# EAGLE design TeknoAmiga (EAGLE 6.4)
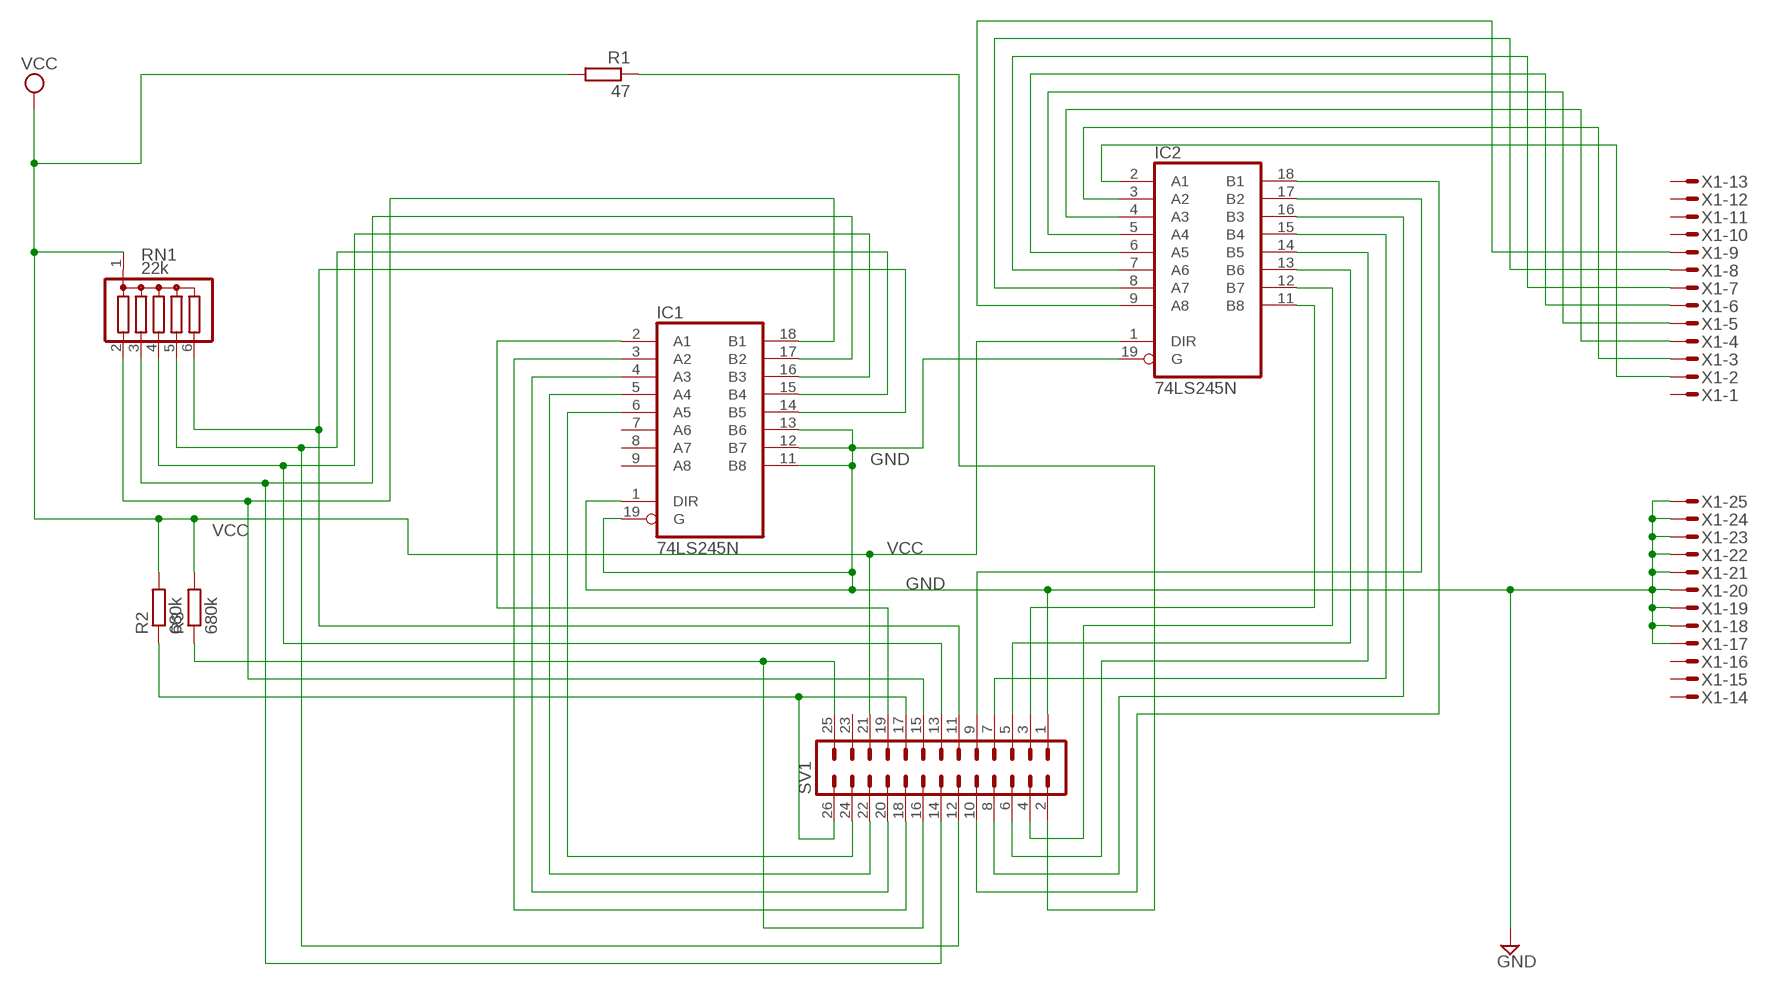
[diagram p0: schematic, sheet 1]

## Parts
IC1  74LS245N  [DIL20]
IC2  74LS245N  [DIL20]
R1  47  R-EU_0207/12  [0207/12]
R2  680k  R-EU_0207/12  [0207/12]
R3  680k  R-EU_0207/12  [0207/12]
RN1  22k  G05R  [SIL6]
SV1  MA13-2  [MA13-2]
X1  M25HPS  [M25HP]

## Nets
GND: IC1.1(DIR) IC1.11(B8) IC1.12(B7) IC1.13(B6) IC1.19(G) IC2.19(G) SV1.1 X1.17 X1.18 X1.19 X1.20 X1.21 X1.22 X1.23 X1.24 X1.25
N$1: IC2.2(A1) X1.2
N$2: IC2.3(A2) X1.3
N$3: IC2.4(A3) X1.4
N$4: IC2.5(A4) X1.5
N$5: IC2.6(A5) X1.6
N$6: IC2.7(A6) X1.7
N$7: IC2.8(A7) X1.8
N$8: IC2.9(A8) X1.9
N$9: IC1.14(B5) RN1.6 SV1.11
N$10: IC1.15(B4) RN1.5 SV1.12
N$11: IC1.16(B3) RN1.4 SV1.13
N$12: IC1.17(B2) RN1.3 SV1.14
N$13: IC1.18(B1) RN1.2 SV1.15
N$14: R2.1 SV1.17 SV1.26
N$15: R3.1 SV1.16 SV1.25
N$16: IC1.6(A5) SV1.24
N$17: IC1.5(A4) SV1.22
N$18: IC1.4(A3) SV1.20
N$19: IC1.3(A2) SV1.18
N$20: IC1.2(A1) SV1.19
N$21: R1.1 SV1.2
N$22: IC2.11(B8) SV1.3
N$23: IC2.12(B7) SV1.4
N$24: IC2.13(B6) SV1.5
N$25: IC2.14(B5) SV1.6
N$26: IC2.15(B4) SV1.7
N$27: IC2.16(B3) SV1.8
N$28: IC2.17(B2) SV1.9
N$29: IC2.18(B1) SV1.10
VCC: IC2.1(DIR) R1.2 R2.2 R3.2 RN1.1 SV1.21
Unconnected: IC1.7(A6) IC1.8(A7) IC1.9(A8) SV1.23 X1.1 X1.10 X1.11 X1.12 X1.13 X1.14 X1.15 X1.16

## Power pins joined to a net without a drawn wire
GND: IC1.10(GND) IC2.10(GND)
VCC: IC1.20(VCC) IC2.20(VCC)

## Library data of the parts
IC1 IC2 = 74xx-eu:74*245: Octal BUS TRANSCEIVER, 3-state
R1-R3 = resistor:R-EU_: RESISTOR, European symbol
RN1 = resistor-sil:G05R: SIL RESISTOR; OC_FARNELL: unknown; OC_NEWARK: unknown
SV1 = con-lstb:MA13-2: PIN HEADER; OC_FARNELL: unknown; OC_NEWARK: unknown
X1 = con-subd:M25?S: SUB-D; OC_FARNELL: unknown; OC_NEWARK: unknown

## Board
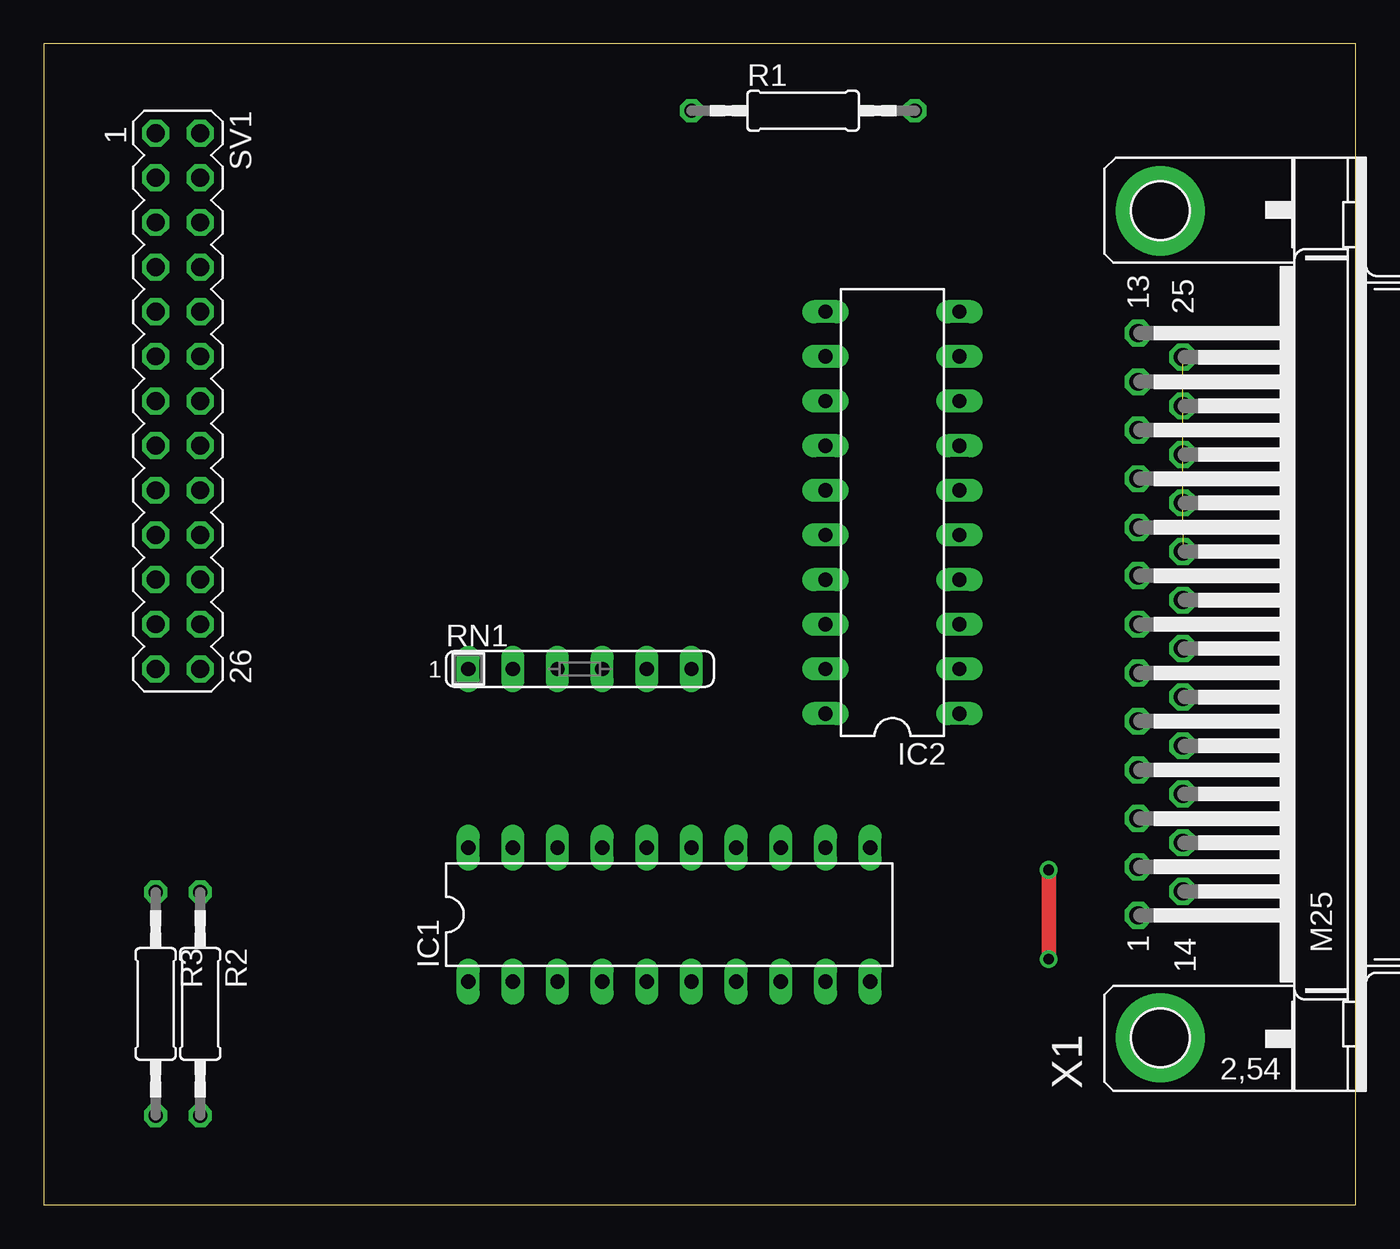
[diagram p1: board, top side]
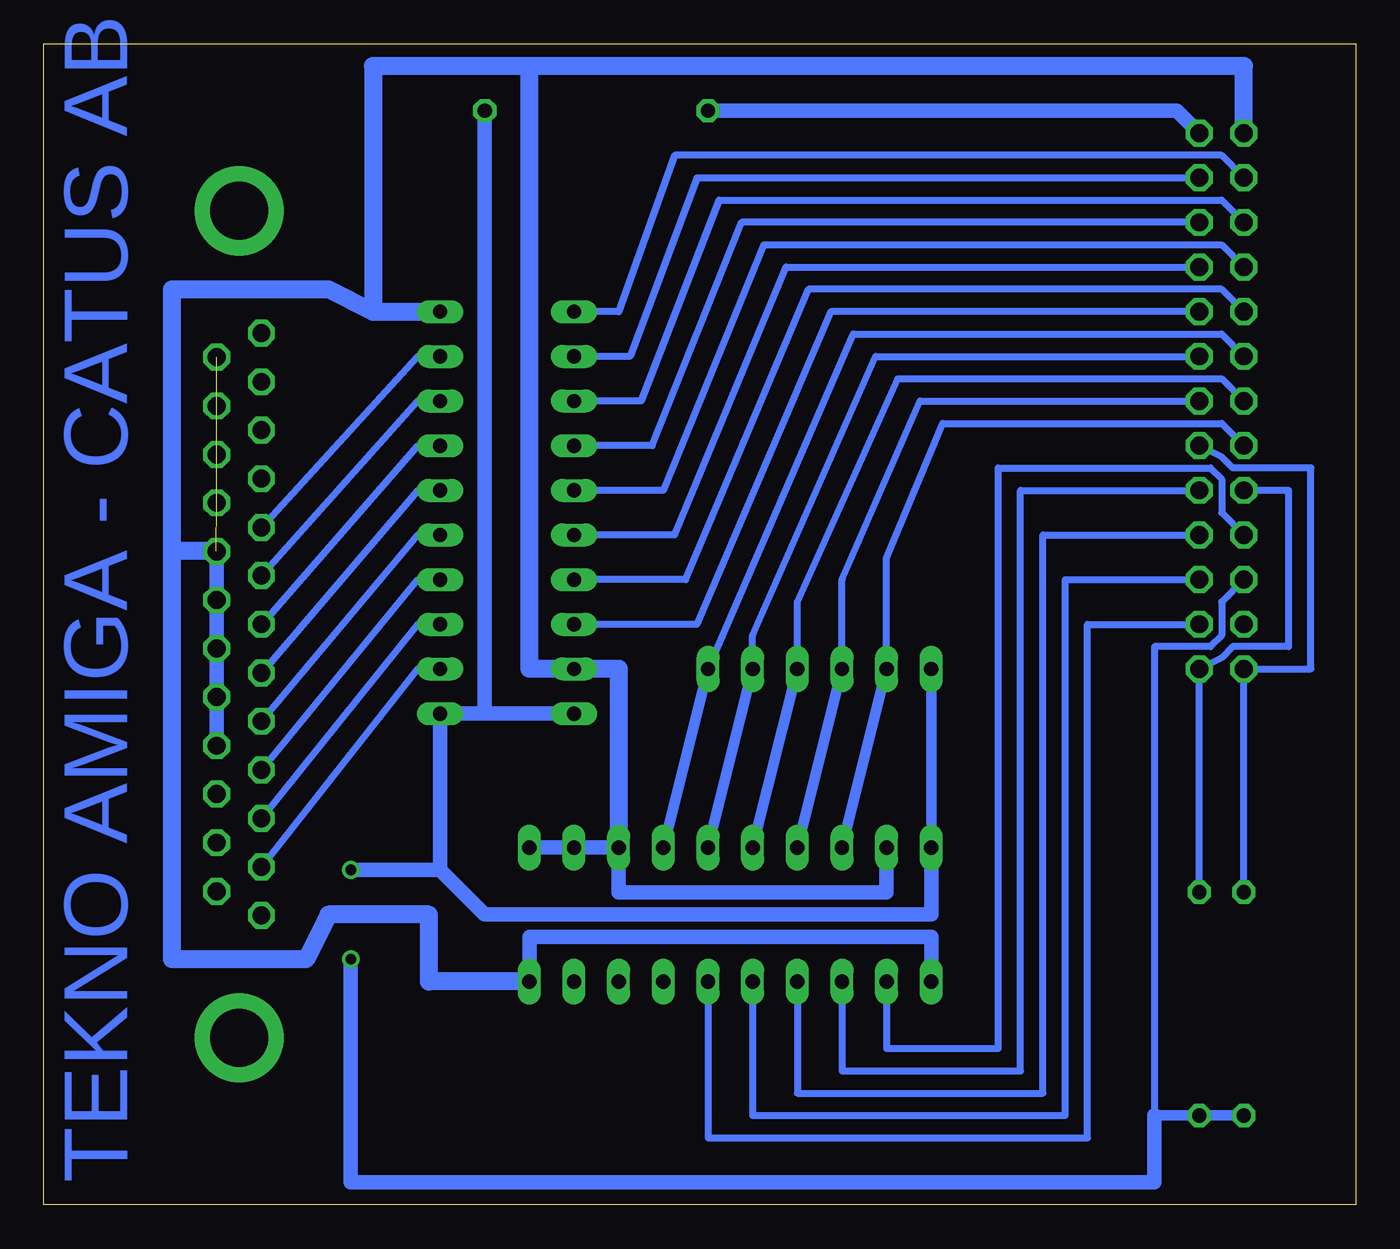
[diagram p2: board, bottom side, seen from below]

Size 74.6 x 66.03 mm. Coordinates in mm from the lower left corner, seen from the top.
Outline: 0,0 74.6,0 74.6,66.03 0,66.03 0,0
Copper layers (1*16): Top 0.035mm / dielectric 1.5mm / Bottom 0.035mm
Design rules "default": minimum track width 10mil, minimum drill 24mil, track to track 8mil, track to pad 8mil, pad to pad 8mil, via to via 8mil, smd to smd 8mil, copper to edge 40mil, drill to drill 8mil, minimum pad ring 10mil, minimum via ring 8mil, stop-mask expansion 4mil, vias tented up to drill 0mil, thermal gap 10mil

### Footprints (pad centres in the part's own frame; a part is rotated, then mirrored left to right if it is on the bottom)
DIL20 = drill 0.813 long: 1 -11.43,-3.81; 2 -8.89,-3.81; 3 -6.35,-3.81; 4 -3.81,-3.81; 5 -1.27,-3.81; 6 1.27,-3.81; 7 3.81,-3.81; 8 6.35,-3.81; 9 8.89,-3.81; 10 11.43,-3.81; 11 11.43,3.81; 12 8.89,3.81; 13 6.35,3.81; 14 3.81,3.81; 15 1.27,3.81; 16 -1.27,3.81; 17 -3.81,3.81; 18 -6.35,3.81; 19 -8.89,3.81; 20 -11.43,3.81
0207/12 = drill 0.813 octagon: 1 -6.35,0; 2 6.35,0
SIL6 = drill 0.813 long: 1 -6.35,0; 2 -3.81,0; 3 -1.27,0; 4 1.27,0; 5 3.81,0; 6 6.35,0
MA13-2 = drill 1.016 octagon: 1 -15.24,-1.27; 2 -15.24,1.27; 3 -12.7,-1.27; 4 -12.7,1.27; 5 -10.16,-1.27; 6 -10.16,1.27; 7 -7.62,-1.27; 8 -7.62,1.27; 9 -5.08,-1.27; 10 -5.08,1.27; 11 -2.54,-1.27; 12 -2.54,1.27; 13 0,-1.27; 14 0,1.27; 15 2.54,-1.27; 16 2.54,1.27; 17 5.08,-1.27; 18 5.08,1.27; 19 7.62,-1.27; 20 7.62,1.27; 21 10.16,-1.27; 22 10.16,1.27; 23 12.7,-1.27; 24 12.7,1.27; 25 15.24,-1.27; 26 15.24,1.27
M25HP = drill 1.016 octagon: 1 -16.561,1.27; 2 -13.792,1.27; 3 -11.049,1.27; 4 -8.28,1.27; 5 -5.512,1.27; 6 -2.769,1.27; 7 0,1.27; 8 2.769,1.27; 9 5.512,1.27; 10 8.28,1.27; 11 11.049,1.27; 12 13.792,1.27; 13 16.561,1.27; 14 -15.189,-1.27; 15 -12.421,-1.27; 16 -9.652,-1.27; 17 -6.909,-1.27; 18 -4.14,-1.27; 19 -1.372,-1.27; 20 1.372,-1.27; 21 4.14,-1.27; 22 6.909,-1.27; 23 9.652,-1.27; 24 12.421,-1.27; 25 15.189,-1.27 | drill 3.302 pad 5.08: G1 -23.52,0; G2 23.52,0

### Placement (x,y rotation side)
IC1  35.56,16.51 0 top
IC2  48.26,39.37 90 top
R1  43.18,62.23 0 top
R2  8.89,11.43 270 top
R3  6.35,11.43 270 top
RN1  30.48,30.48 0 top
SV1  7.62,45.72 270 top
X1  63.5,33.02 90 top

### Tracks (layer width: path | path; a pad name or v marks a point on that pad's centre or on a via)
GND  (4 unrouted)
  Bottom 0.813: IC1.1 24.13,15.24 46.99,15.24 IC1.10 | X1.17 X1.18 X1.19 X1.20 X1.21 | IC1.11 IC1.12 IC1.13 41.91,17.78 26.67,17.78 IC1.19
  Bottom 1.016: IC1.10 52.7,12.7 52.7,16.51 58.42,16.51 59.69,13.97 67.31,13.97 67.31,37.19 | 67.31,37.19 67.31,52.07 58.42,52.07 55.88,50.8 | 55.88,50.8 IC2.10 | X1.21 arc-90 64.8,37.19 67.31,37.19 | IC1.13 41.91,30.48 IC2.19 46.99,30.48 46.99,64.77 | 46.99,64.77 55.88,64.77 55.88,50.8 | SV1.1 6.35,64.77 46.99,64.77
N$1
  Bottom 0.406: X1.2 53.34,30.48 IC2.2
N$2
  Bottom 0.406: X1.3 53.34,33.02 IC2.3
N$3
  Bottom 0.406: X1.4 53.34,35.56 IC2.4
N$4
  Bottom 0.406: X1.5 53.34,38.1 IC2.5
N$5
  Bottom 0.406: X1.6 53.34,40.64 IC2.6
N$6
  Bottom 0.406: X1.7 53.34,43.18 IC2.7
N$7
  Bottom 0.406: X1.8 53.34,45.72 IC2.8
N$8
  Bottom 0.406: X1.9 53.34,48.26 IC2.9
N$9
  Bottom 0.406: RN1.6 28.57,49.53 7.62,49.53 SV1.11
  Bottom 0.61: IC1.14 RN1.6
N$10
  Bottom 0.406: RN1.5 34.29,32.38 27.3,48.26 SV1.12
  Bottom 0.61: IC1.15 RN1.5
N$11
  Bottom 0.406: SV1.13 7.62,46.99 26.04,46.99 31.75,34.29 RN1.4
  Bottom 0.61: IC1.16 RN1.4
N$12
  Bottom 0.406: RN1.3 29.21,35.56 24.77,45.72 SV1.14
  Bottom 0.61: IC1.17 RN1.3
N$13
  Bottom 0.406: SV1.15 7.62,44.45 23.5,44.45 26.67,36.83 RN1.2
  Bottom 0.61: IC1.18 RN1.2
N$14
  Bottom 0.406: R2.1 SV1.26 7.62,31.11 6.99,31.75 3.81,31.75 3.81,40.64 SV1.17
N$15
  Bottom 0.406: R3.1 SV1.25 2.54,30.48 2.54,41.91 6.99,41.91 7.62,42.55 SV1.16
N$16
  Bottom 0.406: IC1.6 36.83,3.81 15.24,3.81 15.24,33.02 SV1.24
N$17
  Bottom 0.406: IC1.5 34.29,5.08 16.51,5.08 16.51,35.56 SV1.22
N$18
  Bottom 0.406: IC1.4 31.75,6.35 17.78,6.35 17.78,38.1 SV1.20
N$19
  Bottom 0.406: IC1.3 29.21,7.62 19.05,7.62 19.05,40.64 SV1.18
N$20
  Bottom 0.406: IC1.2 26.67,8.89 20.32,8.89 20.32,41.91 8.26,41.91 7.62,41.27 7.62,39.37 SV1.19
N$21
  Bottom 0.813: SV1.2 10.16,62.23 R1.1
N$22
  Bottom 0.406: SV1.3 7.62,59.69 38.73,59.69 41.91,50.8 IC2.11
N$23
  Bottom 0.406: SV1.4 37.47,58.42 41.27,48.26 IC2.12
N$24
  Bottom 0.406: SV1.5 7.62,57.15 36.2,57.15 40.64,45.72 IC2.13
N$25
  Bottom 0.406: SV1.6 34.92,55.88 40.01,43.18 IC2.14
N$26
  Bottom 0.406: SV1.7 7.62,54.61 33.66,54.61 39.37,40.64 IC2.15
N$27
  Bottom 0.406: SV1.8 32.38,53.34 38.73,38.1 IC2.16
N$28
  Bottom 0.406: SV1.9 7.62,52.07 31.11,52.07 38.1,35.56 IC2.17
N$29
  Bottom 0.406: SV1.10 29.84,50.8 37.47,33.02 IC2.18
VCC  (via drill 0.6)
  Top 0.813: v57.15,13.97 v57.15,19.05
  Bottom 0.406: SV1.21 7.62,34.29 7.62,32.38 8.26,31.75 11.43,31.75 11.43,5.08
  Bottom 0.61: IC1.20 RN1.1 | R3.2 R2.2 11.43,5.08
  Bottom 0.813: 11.43,5.08 11.43,1.27 57.15,1.27 v57.15,13.97 | v57.15,19.05 52.07,19.05 | 52.07,19.05 49.53,16.51 24.13,16.51 IC1.20 | IC2.20 49.53,27.94 | 49.53,27.94 IC2.1 52.07,19.05 | R1.2 49.53,27.94

### Text on the board
Bottom: TEKNO AMIGA - CATUS AB